# Altium schematic sheet ethernet.SCHDOC: Ethernet PHY
size A4; Organization: Berne University of Applied Science; Address1: School of Engineering and; Address2: Information Technology; Address3: Quellgasse 21; Address4: CH-2501 Biel; Revision: 1.0; SheetNumber: 13; SheetTotal: 19; ApprovedBy: zem1; Author: zac1
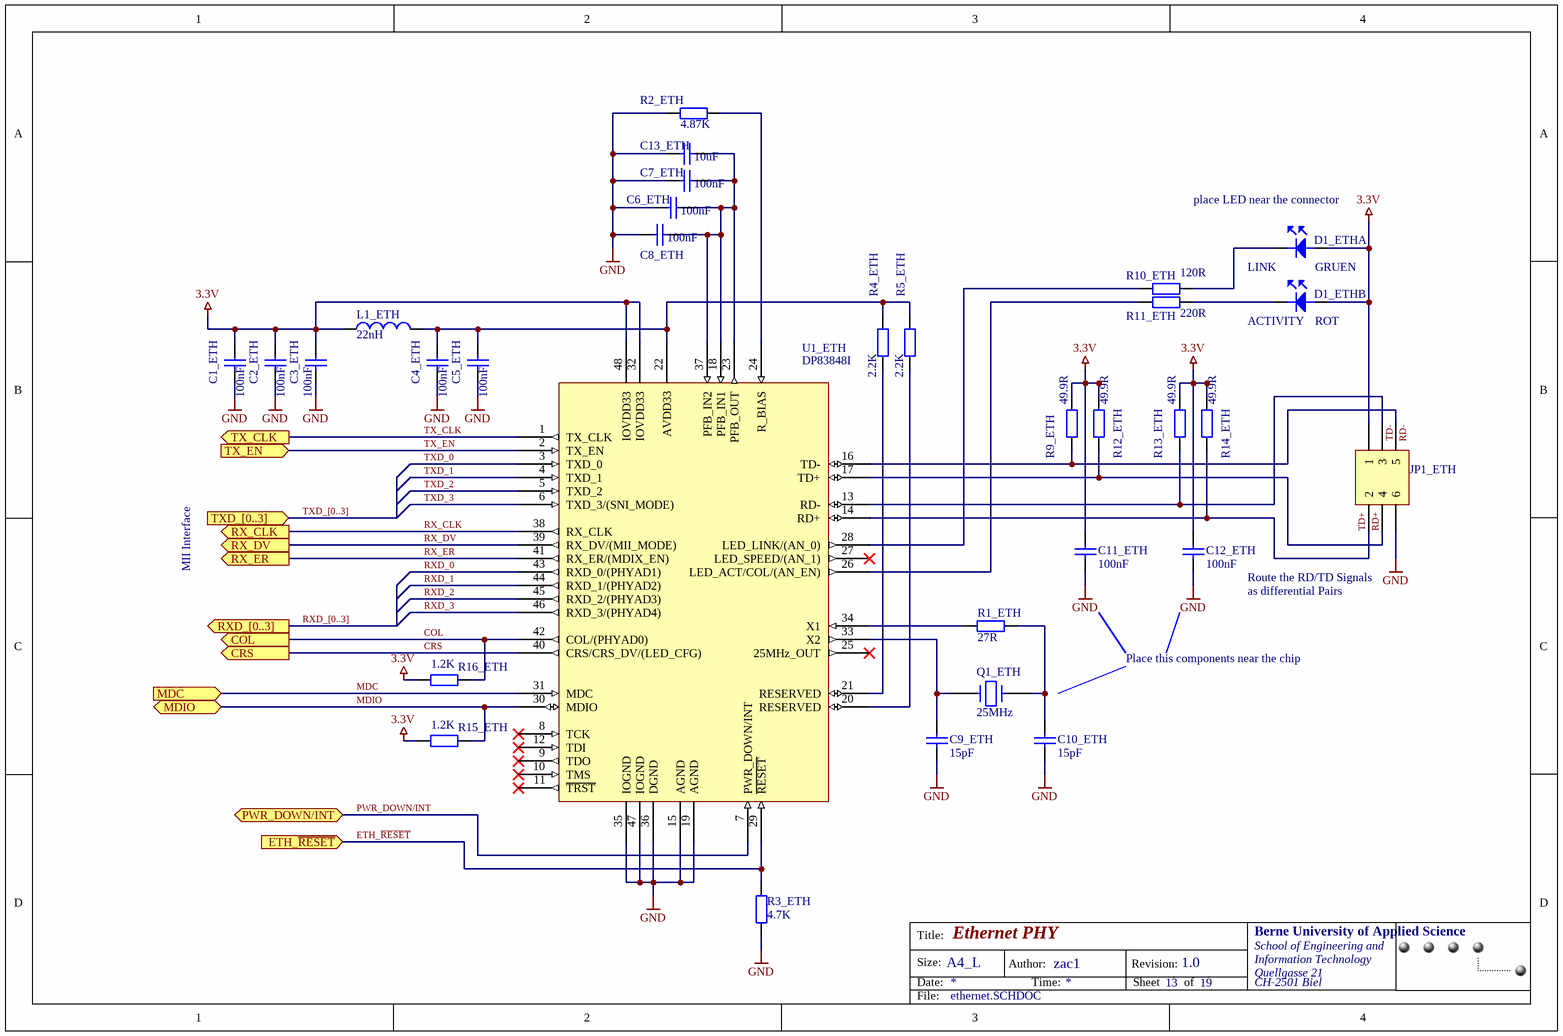
[diagram p0: ethernet.SCHDOC]

## Parts
C1_ETH  value 100nF  [0402]  (hidden comment: Cap)
C2_ETH  value 100nF  [0402]  (hidden comment: Cap)
C3_ETH  value 100nF  [0402]  (hidden comment: Cap)
C4_ETH  value 100nF  [0402]  (hidden comment: Cap)
C5_ETH  value 100nF  [0402]  (hidden comment: Cap)
C6_ETH  value 100nF  [0402]  (hidden comment: Cap)
C7_ETH  value 100nF  [0402]  (hidden comment: Cap)
C8_ETH  value 100nF  [0402]  (hidden comment: Cap)
C9_ETH  value 15pF  [0402]  (hidden comment: Cap)
C10_ETH  value 15pF  [0402]  (hidden comment: Cap)
C11_ETH  value 100nF  [0402]  (hidden comment: Cap)
C12_ETH  value 100nF  [0402]  (hidden comment: Cap)
C13_ETH  value 10uF  [1206]  (hidden comment: Cap)
D1_ETH  1211C-LED  [stan-led4]  (value not drawn)  (parts A,B of 2)
JP1_ETH  M22-2540305  [M22-2540305]  (value not drawn)
L1_ETH  value 22nH  [0603]  (hidden comment: Inductor)
Q1_ETH  value 25MHz  [AT49]  (hidden comment: QUARZ-SMD)
R1_ETH  value 27R  [0402]  (hidden comment: Res2)
R2_ETH  value 4.87K  [0603]  (hidden comment: Res2)
R3_ETH  value 4.7K  [0402]  (hidden comment: Res2)
R4_ETH  value 2.2K  [0402]  (hidden comment: Res2)
R5_ETH  value 2.2K  [0402]  (hidden comment: Res2)
R9_ETH  value 49.9R  [0603]  (hidden comment: Res2)
R10_ETH  value 120R  [0402]  (hidden comment: Res2)
R11_ETH  value 220R  [0402]  (hidden comment: Res2)
R12_ETH  value 49.9R  [0603]  (hidden comment: Res2)
R13_ETH  value 49.9R  [0603]  (hidden comment: Res2)
R14_ETH  value 49.9R  [0603]  (hidden comment: Res2)
R15_ETH  value 1.2K  [0402]  (hidden comment: Res2)
R16_ETH  value 1.2K  [0402]  (hidden comment: Res2)
U1_ETH  DP83848I  [F-QFP7X7-G48/N]

## Ports
COL (out), CRS (out), ETH_~{RESET} (in), MDC (in), MDIO (bidir), PWR_DOWN/INT (bidir), RX_CLK (out), RX_DV (out), RX_ER (out), RXD_[0..3] (out), TX_CLK (out), TX_EN (in), TXD_[0..3] (in)

## Nets
3.3V: C1_ETH.2 C2_ETH.2 C3_ETH.2 C11_ETH.2 C12_ETH.2 D1_ETH.1(A) D1_ETH.3(A) JP1_ETH.1 L1_ETH.1 R9_ETH.2 R12_ETH.2 R13_ETH.2 R14_ETH.2 R15_ETH.1 R16_ETH.1 U1_ETH.32(IOVDD33) U1_ETH.48(IOVDD33)
GND: C1_ETH.1 C2_ETH.1 C3_ETH.1 C4_ETH.1 C5_ETH.1 C6_ETH.1 C7_ETH.1 C8_ETH.1 C9_ETH.1 C10_ETH.1 C11_ETH.1 C12_ETH.1 C13_ETH.1 JP1_ETH.6 R2_ETH.1 R3_ETH.1 U1_ETH.15(AGND) U1_ETH.19(AGND) U1_ETH.35(IOGND) U1_ETH.36(DGND) U1_ETH.47(IOGND)
COL: R16_ETH.2 U1_ETH.42(COL/(PHYAD0)) ; port COL
CRS: U1_ETH.40(CRS/CRS_DV/(LED_CFG)) ; port CRS
ETH_~{RESET}: R3_ETH.2 U1_ETH.29(~{RESET}) ; port ETH_~{RESET}
MDC: U1_ETH.31(MDC) ; port MDC
MDIO: R15_ETH.2 U1_ETH.30(MDIO) ; port MDIO
PWR_DOWN/INT: U1_ETH.7(PWR_DOWN/INT) ; port PWR_DOWN/INT
RD+: JP1_ETH.4 R12_ETH.1 U1_ETH.17(TD+)
RD-: JP1_ETH.5 R9_ETH.1 U1_ETH.16(TD-)
RX_CLK: U1_ETH.38(RX_CLK) ; port RX_CLK
RX_DV: U1_ETH.39(RX_DV/(MII_MODE)) ; port RX_DV
RX_ER: U1_ETH.41(RX_ER/(MDIX_EN)) ; port RX_ER
RXD_0: U1_ETH.43(RXD_0/(PHYAD1))
RXD_1: U1_ETH.44(RXD_1/(PHYAD2))
RXD_2: U1_ETH.45(RXD_2/(PHYAD3))
RXD_3: U1_ETH.46(RXD_3/(PHYAD4))
TD+: JP1_ETH.2 R14_ETH.1 U1_ETH.14(RD+)
TD-: JP1_ETH.3 R13_ETH.1 U1_ETH.13(RD-)
TX_CLK: U1_ETH.1(TX_CLK) ; port TX_CLK
TX_EN: U1_ETH.2(TX_EN) ; port TX_EN
TXD_0: U1_ETH.3(TXD_0)
TXD_1: U1_ETH.4(TXD_1)
TXD_2: U1_ETH.5(TXD_2)
TXD_3: U1_ETH.6(TXD_3/(SNI_MODE))
NetC4_ETH_2: C4_ETH.2 C5_ETH.2 L1_ETH.2 R4_ETH.2 R5_ETH.2 U1_ETH.22(AVDD33)
NetC6_ETH_2: C6_ETH.2 C7_ETH.2 C8_ETH.2 C13_ETH.2 U1_ETH.18(PFB_IN1) U1_ETH.23(PFB_OUT) U1_ETH.37(PFB_IN2)
NetC9_ETH_2: C9_ETH.2 Q1_ETH.1 U1_ETH.33(X2)
NetC10_ETH_2: C10_ETH.2 Q1_ETH.2 R1_ETH.1
NetD1_ETH_2: D1_ETH.2(K) R11_ETH.1
NetD1_ETH_4: D1_ETH.4(K) R10_ETH.1
NetR1_ETH_2: R1_ETH.2 U1_ETH.34(X1)
NetR2_ETH_2: R2_ETH.2 U1_ETH.24(R_BIAS)
NetR4_ETH_1: R4_ETH.1 U1_ETH.21(RESERVED)
NetR5_ETH_1: R5_ETH.1 U1_ETH.20(RESERVED)
NetR10_ETH_2: R10_ETH.2 U1_ETH.28(LED_LINK/(AN_0))
NetR11_ETH_2: R11_ETH.2 U1_ETH.26(LED_ACT/COL/(AN_EN))

Not connected (* = marked no-connect by the designer): U1_ETH 8(TCK)* 9(TDO)* 10(TMS)* 11(~{TRST})* 12(TDI)* 25(25MHz_OUT)* 27(LED_SPEED/(AN_1))*

## Buses and harness runs
bus RXD_[0..3] = port RXD_[0..3]
bus TXD_[0..3] = port TXD_[0..3]

## Notes on the sheet
- (near D1_ETH) place LED near the connector
- (near D1_ETH) LINK
- (near D1_ETH) ACTIVITY
- MII Interface
- Route the RD/TD Signals
- as differential Pairs
- Place this components near the chip
- Title:
- Size:
- Date:
- A4_L
- Author:
- Time:
- Revision:
- Sheet
- of
- File:
- (in symbol 1211C-LED, part A) GRUEN
- (in symbol 1211C-LED, part B) ROT

## Library data of the parts
C1_ETH C2_ETH C3_ETH C4_ETH C5_ETH C6_ETH C7_ETH C8_ETH C11_ETH C12_ETH = Cap: Capacitor; Manufacturer: Murata; Part Number: GRM155R71C104KA88D; Class I: Passive; Currency: CHF; Packaging unit: 10; Prize: 0.07; Published: 8-Jun-2000; Revision: July-2002: Re-released for DXP Platform.; Publisher: Altium Limited; Class II: Capacitor; Distributor Number: 8819 742; RoHS: yes; Distributor: Farnell
C9_ETH C10_ETH = Cap: Capacitor; Manufacturer: AVX; Part Number: 04025A150JAT2A; Class I: Passive; Currency: CHF; Packaging unit: 1; Prize: 0.07; Published: 8-Jun-2000; Revision: July-2002: Re-released for DXP Platform.; Publisher: Altium Limited; Class II: Capacitor; Distributor Number: 1327 631; RoHS: yes; Distributor: Farnell
C13_ETH = Cap: Capacitor; Manufacturer: Murata; Part Number: GRM31CR70J106KA01L; Class I: Passive; Currency: CHF; Packaging unit: 1; Prize: 0.25; Published: 8-Jun-2000; Revision: July-2002: Re-released for DXP Platform.; Publisher: Altium Limited; Class II: Capacitor; Distributor Number: 9527 729; RoHS: yes; Distributor: Farnell
D1_ETH = 1211C-LED: Stanley 1211C Bi-Color Ultra Compact SMT LED; Value: BRBG1211C; Currency: CHF; Packaging unit: 1; Prize: 0.86; Distributor Number: 253183; Manufacturer: Stanley; Part Number: BRBG1211C; RoHS: yes; Distributor: Distrelec
JP1_ETH = M22-2540305: Manufacturer: HARWIN; Part Number: M22F2040305; Currency: CHF; Packaging unit: 1; Prize: 2.3; VALUE: M22-2540305; Distributor Number: 672 210; RoHS: yes; Distributor: Farnell
L1_ETH = Inductor: Manufacturer: Panasonic; Part Number: ELJRE22NJFA; Class I: Passive; Currency: CHF; Packaging unit: 5; Prize: 0.45; Published: 8-Jun-2000; Revision: July-2002: Re-released for DXP Platform.; Publisher: Altium Limited; Class II: Inductor; Distributor Number: 1198381; RoHS: yes; Distributor: Farnell
Q1_ETH = QUARZ-SMD: SMD Quarz in the AT49 Case, like the ABLS series from Abracon; Part Number: ABLS-25.000MHZ-B2F-T; Currency: CHF; Packaging unit: 1; Prize: 0.53; lead time: 2 Weeks; Distributor Number: 7940579; Manufacturer: ABRACON; RoHS: yes; Distributor: Farnell
R1_ETH = Res2: Resistor; Manufacturer: PHYCOMP; Part Number: 232270672709; Class I: Passive; Currency: CHF; Packaging unit: 50; Prize: 0.12; Published: 8-Jun-2000; Revision: July-2002: Re-released for DXP Platform.; Publisher: Altium Limited; Class II: Resistor; Distributor Number: 9239049; RoHS: yes; Distributor: Farnell
R2_ETH = Res2: Resistor; Manufacturer: Multicomp; Part Number: MC 0.063W 0603 1% 4K87; Class I: Passive; Currency: CHF; Packaging unit: 50; Prize: 0.09; Published: 8-Jun-2000; Revision: July-2002: Re-released for DXP Platform.; Publisher: Altium Limited; Class II: Resistor; Distributor Number: 1170858; RoHS: X-yes; Distributor: Farnell
R3_ETH = Res2: Resistor; Manufacturer: PHYCOMP; Part Number: 232270674702; Class I: Passive; Currency: CHF; Packaging unit: 50; Prize: 0.12; Published: 8-Jun-2000; Revision: July-2002: Re-released for DXP Platform.; Publisher: Altium Limited; Class II: Resistor; Distributor Number: 9239316; RoHS: yes; Distributor: Farnell
R4_ETH R5_ETH = Res2: Resistor; Manufacturer: PHYCOMP; Part Number: 232270672202; Class I: Passive; Currency: CHF; Packaging unit: 50; Prize: 0.12; Published: 8-Jun-2000; Revision: July-2002: Re-released for DXP Platform.; Publisher: Altium Limited; Class II: Resistor; Distributor Number: 9239278; RoHS: yes; Distributor: Farnell
R9_ETH R12_ETH R13_ETH R14_ETH = Res2: Resistor; Manufacturer: Multicomp; Part Number: MC 0.063W 0603 1% 49R9; Class I: Passive; Currency: CHF; Packaging unit: 50; Prize: 0.06; Published: 8-Jun-2000; Revision: July-2002: Re-released for DXP Platform.; Publisher: Altium Limited; Class II: Resistor; Distributor Number: 1170658; RoHS: X-yes; Distributor: Farnell
R10_ETH = Res2: Resistor; Manufacturer: PHYCOMP; Part Number: 232270671201; Class I: Passive; Currency: CHF; Packaging unit: 50; Prize: 0.12; Published: 8-Jun-2000; Revision: July-2002: Re-released for DXP Platform.; Publisher: Altium Limited; Class II: Resistor; Distributor Number: 9239120; RoHS: yes; Distributor: Farnell
R11_ETH = Res2: Resistor; Manufacturer: PHYCOMP; Part Number: 232270672201; Class I: Passive; Currency: CHF; Packaging unit: 50; Prize: 0.12; Published: 8-Jun-2000; Revision: July-2002: Re-released for DXP Platform.; Publisher: Altium Limited; Class II: Resistor; Distributor Number: 9239154; RoHS: yes; Distributor: Farnell
R15_ETH R16_ETH = Res2: Resistor; Manufacturer: PHYCOMP; Part Number: 232270671202; Class I: Passive; Currency: CHF; Packaging unit: 50; Prize: 0.12; Published: 8-Jun-2000; Revision: July-2002: Re-released for DXP Platform.; Publisher: Altium Limited; Class II: Resistor; Distributor Number: 9239243; RoHS: yes; Distributor: Farnell
U1_ETH = DP83848I: Single Port 10/100 Mb/s Ethernet Physical Layer Transceiver; Manufacturer: National; Part Number: DP83848IVV/NOPB; Currency: CHF; Packaging unit: 1; Prize: 5.55; Value: DP83848I; Distributor Number: DP83848IVV/NOPB; RoHS: yes; Distributor: EBV